# Altium schematic sheet Connector.SchDoc: Heart-Rate Monitor
size B; DrawnBy: Evan Reeves; Revision: A; SheetNumber: 1; SheetTotal: 2
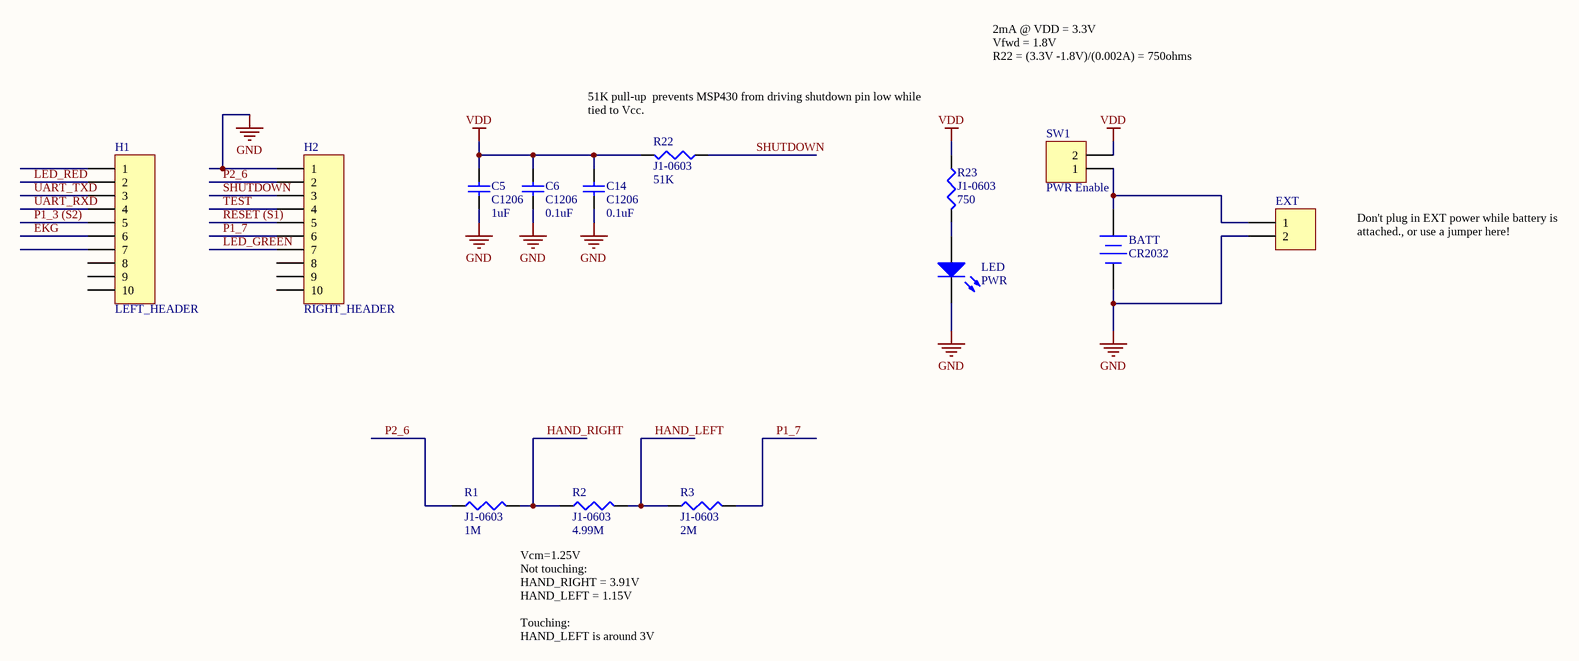
[diagram p0: Connector.SchDoc]

## Parts
BATT  CR2032  [BAT_3003]
C5  C1206  value 1uF  [C1206]
C6  C1206  value 0.1uF  [C1206]
C14  C1206  value 0.1uF  [C1206]
EXT  (no value)  [BAT-2]
H1  LEFT_HEADER  [HDR1X10]
H2  RIGHT_HEADER  [HDR1X10]
LED  PWR  [RESC0603N]
R1  J1-0603  value 1M  [RESC0603N]
R2  J1-0603  value 4.99M  [RESC0603N]
R3  J1-0603  value 2M  [RESC0603N]
R22  J1-0603  value 51K  [RESC0603N]
R23  J1-0603  value 750  [RESC0603N]
SW1  PWR Enable  [HDR1X2]

## Nets
GND: BATT.2(-) C5.1 C6.1 C14.1 EXT.2 H2.1 LED.2(K)
VDD: C5.2 C6.2 C14.2 R22.2 R23.1 SW1.2
EKG: H1.6
HAND_LEFT: R2.2 R3.1
HAND_RIGHT: R1.2 R2.1
LED_GREEN: H2.7
LED_RED: H1.2
P1_3 (S2): H1.5
P1_7: H2.6 R3.2
P2_6: H2.2 R1.1
RESET (S1): H2.5
SHUTDOWN: H2.3 R22.1
TEST: H2.4
UART_RXD: H1.4
UART_TXD: H1.3
NetBATT_1: BATT.1(+) EXT.1 SW1.1
NetLED_1: LED.1(A) R23.2

Not connected (* = marked no-connect by the designer): H1 1 7 8 9 10; H2 8 9 10

## Notes on the sheet
- 2mA @ VDD = 3.3V
  Vfwd = 1.8V
  R22 = (3.3V -1.8V)/(0.002A) = 750ohms
- (near R22) 51K pull-up  prevents MSP430 from driving shutdown pin low while tied to Vcc.
- Don't plug in EXT power while battery is attached., or use a jumper here!
- Vcm=1.25V
  Not touching:
  HAND_RIGHT = 3.91V
  HAND_LEFT = 1.15V
  Touching:
  HAND_LEFT is around 3V
- Title
- Size:
- Date:
- B
- Number:
- Time:
- Revision:
- Sheet
- of
- File:

## Library data of the parts
BATT = Battery: Multicell Battery; pin to pad: 1>MH1; Published: 24-Mar-1999; LatestRevisionDate: 17-Jul-2002; LatestRevisionNote: Re-released for DXP Platform.; PackageReference: BAT-2; Publisher: Altium Limited; PackageDescription: Battery; 2 Leads
C5 C6 C14 = Cap Semi: Capacitor (Semiconductor SIM Model); Published: 8-Jun-2000; LatestRevisionDate: 29-May-2009; LatestRevisionNote: IPC-7351 Footprint Added.; PackageReference: C1206; Publisher: Altium Limited; PackageDescription: Chip Capacitor
EXT SW1 = Header 2: Header, 2-Pin; LatestRevisionDate: 17-Jul-2002; LatestRevisionNote: Re-released for DXP Platform.; Publisher: Altium Limited
H1 H2 = Header 10: Header, 10-Pin; LatestRevisionDate: 17-Jul-2002; LatestRevisionNote: Re-released for DXP Platform.; Publisher: Altium Limited
LED = LED2: RED LED; PN: SML-311UTT86; Published: 8-Jun-2000; LatestRevisionDate: 17-Jul-2002; LatestRevisionNote: Re-released for DXP Platform.; PackageVersion: Feb-2002; PackageReference: 0603; Publisher: Altium Limited; PackageDescription: SM LED; 2 Flat Leads; Link: https://www.digikey.com/product-detail/en/rohm-semiconductor/SML-311UTT86/511-1304-1-ND/637117
R1-R3 R22 R23 = Res3: Resistor; Published: 8-Jun-2000; LatestRevisionDate: 29-May-2009; LatestRevisionNote: IPC-7351 Footprint Added.; PackageReference: J1-0603; Publisher: Altium Limited; PackageDescription: Chip Resistor